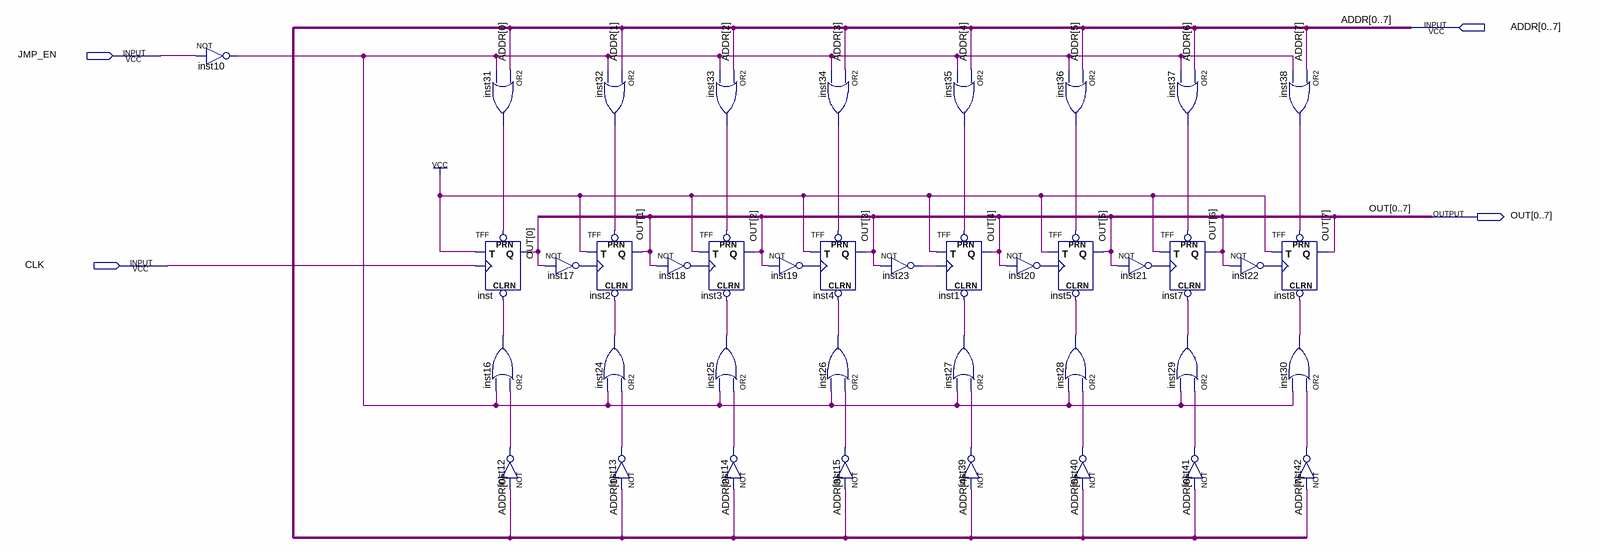
[diagram p0: schematic sheet]
// Quartus schematic contador.bdf as structural Verilog: 40 symbols, 4 pins
module contador (
  input  [0:7] ADDR,
  input  JMP_EN,
  input  CLK,
  output [0:7] OUT
);

  wire inst10_out, inst12_out, inst13_out, inst14_out, inst15_out, inst16_out, inst17_out, inst18_out,
       inst19_out, inst20_out, inst21_out, inst22_out, inst23_out, inst24_out, inst25_out, inst26_out,
       inst27_out, inst28_out, inst29_out, inst30_out, inst31_out, inst32_out, inst33_out, inst34_out,
       inst35_out, inst36_out, inst37_out, inst38_out, inst39_out, inst40_out, inst41_out, inst42_out;

  not inst10 (inst10_out, JMP_EN);
  or inst31 (inst31_out, ADDR[0], inst10_out);
  TFF inst (.PRN(inst31_out), .CLRN(inst16_out), .T(1'b1), .CLK(CLK), .Q(OUT[0]));
  or inst16 (inst16_out, inst12_out, inst10_out);
  not inst12 (inst12_out, ADDR[0]);
  not inst17 (inst17_out, OUT[0]);
  or inst32 (inst32_out, ADDR[1], inst10_out);
  TFF inst2 (.PRN(inst32_out), .CLRN(inst24_out), .T(1'b1), .CLK(inst17_out), .Q(OUT[1]));
  or inst24 (inst24_out, inst13_out, inst10_out);
  not inst13 (inst13_out, ADDR[1]);
  not inst18 (inst18_out, OUT[1]);
  or inst33 (inst33_out, ADDR[2], inst10_out);
  TFF inst3 (.PRN(inst33_out), .CLRN(inst25_out), .T(1'b1), .CLK(inst18_out), .Q(OUT[2]));
  or inst25 (inst25_out, inst14_out, inst10_out);
  not inst14 (inst14_out, ADDR[2]);
  not inst19 (inst19_out, OUT[2]);
  or inst34 (inst34_out, ADDR[3], inst10_out);
  TFF inst4 (.PRN(inst34_out), .CLRN(inst26_out), .T(1'b1), .CLK(inst19_out), .Q(OUT[3]));
  or inst26 (inst26_out, inst15_out, inst10_out);
  not inst15 (inst15_out, ADDR[3]);
  not inst23 (inst23_out, OUT[3]);
  or inst35 (inst35_out, ADDR[4], inst10_out);
  TFF inst1 (.PRN(inst35_out), .CLRN(inst27_out), .T(1'b1), .CLK(inst23_out), .Q(OUT[4]));
  or inst27 (inst27_out, inst39_out, inst10_out);
  not inst39 (inst39_out, ADDR[4]);
  not inst20 (inst20_out, OUT[4]);
  or inst36 (inst36_out, ADDR[5], inst10_out);
  TFF inst5 (.PRN(inst36_out), .CLRN(inst28_out), .T(1'b1), .CLK(inst20_out), .Q(OUT[5]));
  or inst28 (inst28_out, inst40_out, inst10_out);
  not inst40 (inst40_out, ADDR[5]);
  not inst21 (inst21_out, OUT[5]);
  or inst37 (inst37_out, ADDR[6], inst10_out);
  TFF inst7 (.PRN(inst37_out), .CLRN(inst29_out), .T(1'b1), .CLK(inst21_out), .Q(OUT[6]));
  or inst29 (inst29_out, inst41_out, inst10_out);
  not inst41 (inst41_out, ADDR[6]);
  not inst22 (inst22_out, OUT[6]);
  or inst38 (inst38_out, ADDR[7], inst10_out);
  TFF inst8 (.PRN(inst38_out), .CLRN(inst30_out), .T(1'b1), .CLK(inst22_out), .Q(OUT[7]));
  or inst30 (inst30_out, inst42_out, inst10_out);
  not inst42 (inst42_out, ADDR[7]);
endmodule
